# Altium schematic sheet Page02 BLOCK DIAGRAM.SchDoc
size 513 x 386 mm
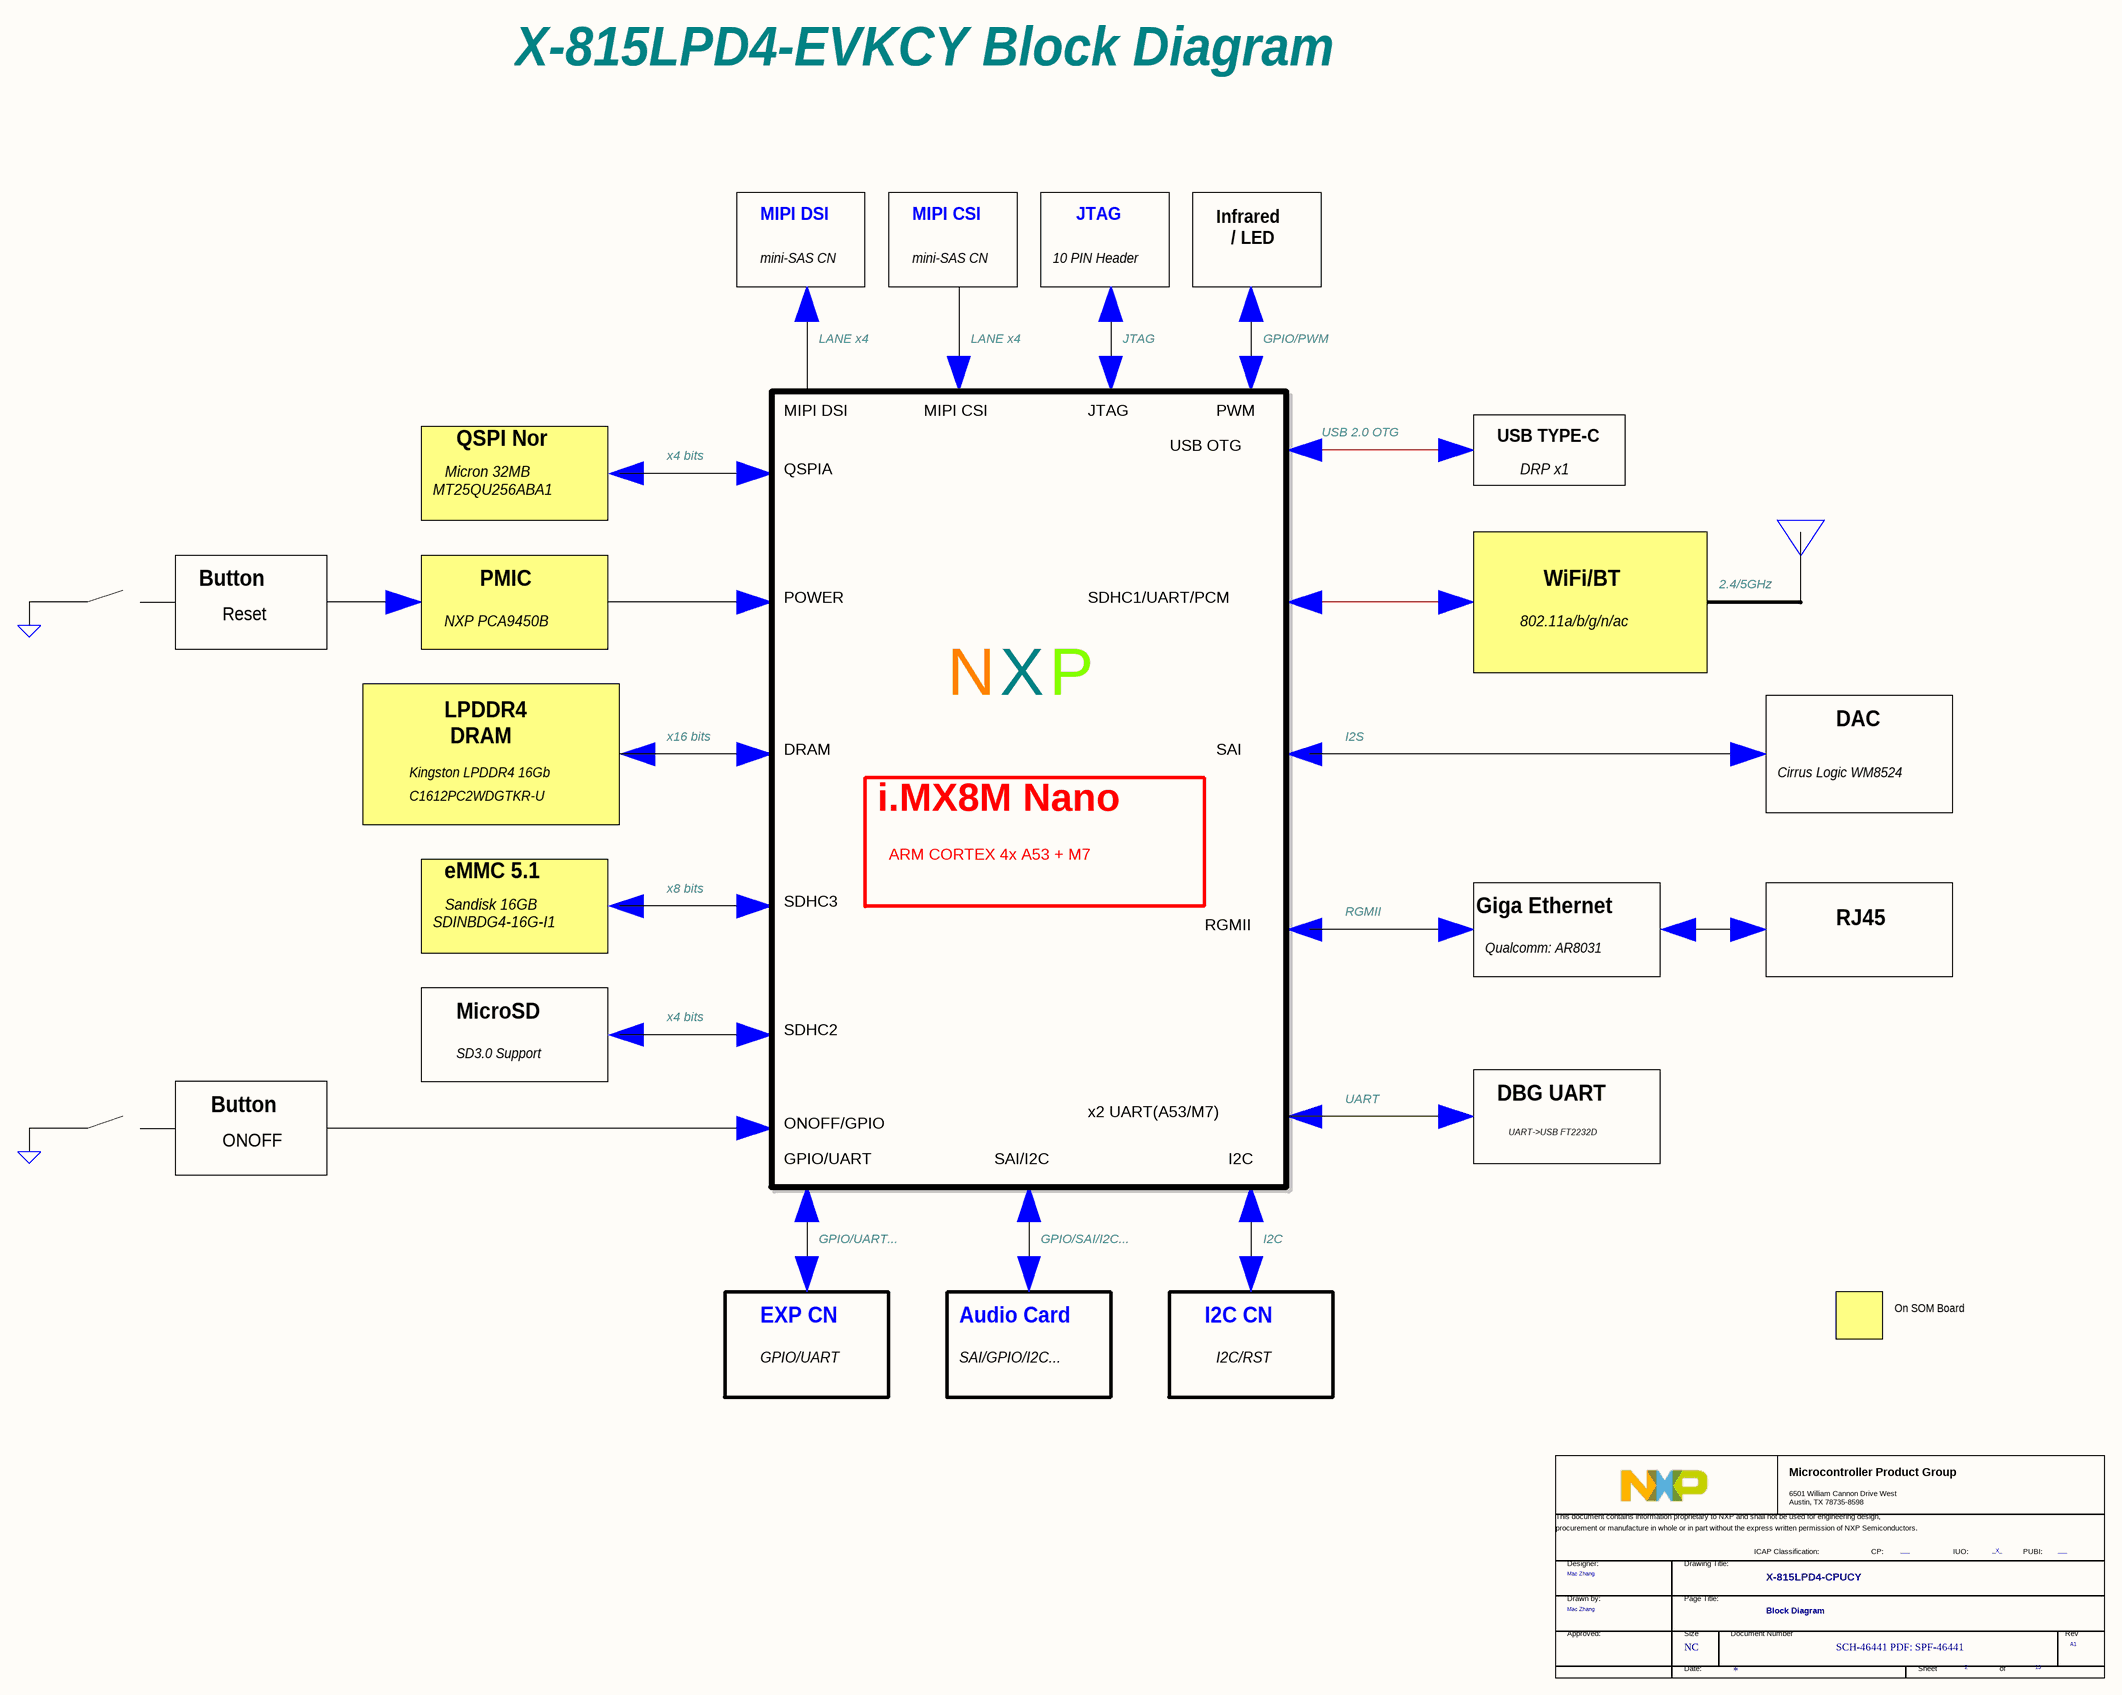
[diagram p0: Page02 BLOCK DIAGRAM.SchDoc]

## Parts
*  Doc: SCH-46441 PDF: SPF-46441  RevCode: A1  Title: X-815LPD4-CPUCY  Page Size: NC  Page Number: 2  Page Count: 13  PageTitle: Block Diagram  Designer: Mac Zhang  PUBI: ___  FIUO: _X_  (hidden comment: TitleBlock_MCPG)  (graphical)

## Notes on the sheet
- X-815LPD4-EVKCY Block Diagram
- MIPI DSI
- MIPI CSI
- JTAG
- Infrared
  / LED
- mini-SAS CN
- 10 PIN Header
- LANE x4
- GPIO/PWM
- PWM
- Micron 32MB
  MT25QU256ABA1
- QSPI Nor
- x4 bits
- QSPIA
- USB OTG
- USB 2.0 OTG
- USB TYPE-C
- DRP x1
- Button
- Reset
- PMIC
- WiFi/BT
- 2.4/5GHz
- NXP PCA9450B
- POWER
- SDHC1/UART/PCM
- 802.11a/b/g/n/ac
- LPDDR4
  DRAM
- N
- X
- P
- Kingston LPDDR4 16Gb
- x16 bits
- DRAM
- SAI
- I2S
- Cirrus Logic WM8524
- DAC
- C1612PC2WDGTKR-U
- i.MX8M Nano
- Sandisk 16GB
  SDINBDG4-16G-I1
- eMMC 5.1
- x8 bits
- ARM CORTEX 4x A53 + M7
- SDHC3
- RGMII
- Giga Ethernet
- Qualcomm: AR8031
- RJ45
- SD3.0 Support
- MicroSD
- SDHC2
- ONOFF
- ONOFF/GPIO
- x2 UART(A53/M7)
- UART
- DBG UART
- GPIO/UART
- SAI/I2C
- I2C
- UART->USB FT2232D
- GPIO/UART...
- GPIO/SAI/I2C...
- EXP CN
- Audio Card
- SAI/GPIO/I2C...
- I2C CN
- I2C/RST
- On SOM Board
- (in symbol TitleBlock_MCPG) Microcontroller Product Group; 6501 William Cannon Drive West / Austin, TX 78735-8598; This document contains information proprietary to NXP and shall not be used for engineering design,; procurement or manufacture in whole or in part without the express written permission of NXP Semiconductors.; ICAP Classification:; CP:; IUO:; PUBI:; Designer:; Drawing Title:; Drawn by:; Page Title:; Approved:; Size; Document Number; Rev; Date:; Sheet; of

## Library data of the parts
* = TitleBlock_MCPG: OrgAddr1: NO. 192 Liangjing Rd. Pudong New Area, ShangHai; OrgName: NXP Semiconductor; Page Create Date: March  8, 1995; DrawnBy: Mac Zhang; FCP: ___; Page Modify Date: *